# EAGLE schematic Rover IR Temp Sensor (EAGLE 7.1.0)
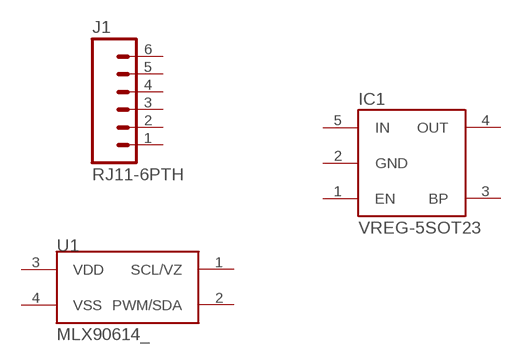
[diagram p0: schematic, sheet 1]

## Parts
IC1  VREG-5SOT23  [SOT23-5]
J1  RJ11-6PTH  [RJ11-6]
U1  MLX90614_  [TO-39]
Unconnected: IC1.1(EN) IC1.3(BP) J1.1 J1.2 J1.3 J1.4 J1.5 J1.6 U1.1(SCL/VZ) U1.2(PWM/SDA) U1.3(VDD) U1.4(VSS)

## Power pins joined to a net without a drawn wire
GND: IC1.2(GND)
IN: IC1.5(IN)
OUT: IC1.4(OUT)

## Library data of the parts
IC1 = Jordi:VREG-5
J1 = SparkFun-Connectors:RJ11-6: RJ11 Jack Simple 6 pin RJ11 jack. Commonly found on CAT3 devices and Microchip programmers. SKU: PRT-00132
U1 = SparkFun-Sensors:MLX90614: Non-contact PIR I2C interface temperature sensor